# Altium project drone_sensor.PrjPcb
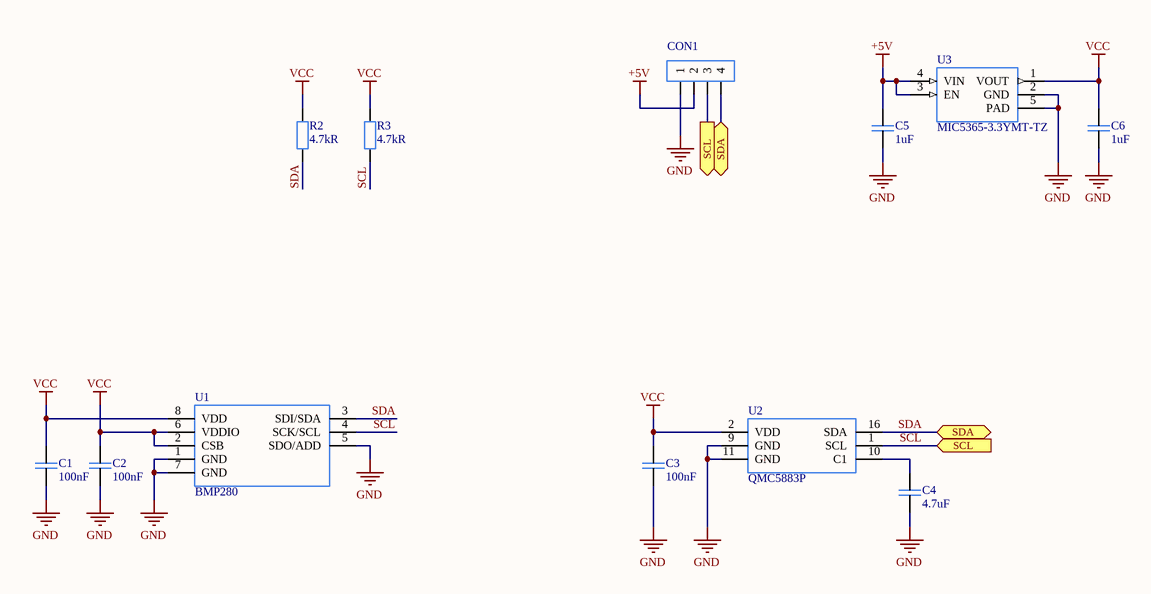
[diagram p0: Sheet1.SchDoc]
1 sheet, 12 parts. Net scope: flat (ports and power ports of the same name join across sheets).
Board file: PCB1.PcbDoc

## Sheet Sheet1.SchDoc
size A4; SheetNumber: 1; SheetTotal: 1

### Parts
C1  100nF  [C0201_M]
C2  100nF  [C0201_M]
C3  100nF  [C0201_M]
C4  4.7uF  [C0402_N]
C5  1uF  [C0201_M]
C6  1uF  [C0201_M]
CON1  Header 4  [HEADER-4-2mm]  (value not drawn)
R2  4.7kR  [R0201_L]
R3  4.7kR  [R0201_L]
U1  BMP280  [LGA-8]
U2  QMC5883P  [LGA-16_3X3]
U3  MIC5365-3.3YMT-TZ  [UDFN-4]

### Ports
SCL (in, see Sheet1[3B]), SCL (out, see Sheet1[3C]), SDA (bidir, see Sheet1[3B]), SDA (bidir, see Sheet1[3C])

### Nets
+5V: C5.1 CON1.2 U3.3(EN) U3.4(VIN)
GND: C1.2 C2.1 C3.1 C4.2 C5.2 C6.2 CON1.1 U1.1(GND) U1.5(SDO/ADD) U1.7(GND) U2.9(GND) U2.11(GND) U3.2(GND) U3.5(PAD)
VCC: C1.1 C2.2 C3.2 C6.1 R2.1 R3.1 U1.2(CSB) U1.6(VDDIO) U1.8(VDD) U2.2(VDD) U3.1(VOUT)
SCL: CON1.3 R3.2 U1.4(SCK/SCL) U2.1(SCL) ; port SCL
SDA: CON1.4 R2.2 U1.3(SDI/SDA) U2.16(SDA) ; port SDA
NetC4_1: C4.1 U2.10(C1)

Not connected (* = marked no-connect by the designer): U2 3(NC) 4(NC) 5(NC) 6(NC) 7(NC) 8(NC) 12(NC) 13(NC) 14(NC) 15(NC)

### Library data of the parts
C1-C3 = Capacitor: Cap Ceramic 0.1uF 25V X5R 10% SMD 0201 85°C Paper T/R; Manufacturer: Yageo; Manufacturer Part Number: CC0201KRX5R8BB104; User_Description: Cap Ceramic 0.1uF 25V X5R 10% SMD 0201 85°C Paper T/R; Supplier: Digi-Key; Supplier Part Number: 13-CC0201KRX5R8BB104CT-ND; RoHS: Yes; Category: Ceramic Capacitors; Stock: 60990; Pricing: 1=0,10000, 10=0,06500, 50=0,03560, 100=0,02900, 500=0,02072, 1000=0,01628, 2500=0,01480, 5000=0,01361 (USD); RoHS Compliant: Yes; ComponentLink1URL: https://www.yageo.com/upload/media/product/productsearch/datasheet/mlcc/UPY-GPHC_X5R_4V-to-50V_26.pdf?src-supplier=Digi-Key; ComponentLink1Description: https://www.yageo.com/upload/media/product/productsearch/datasheet/mlcc/UPY-GPHC_X5R_4V-to-50V_26.pdf?src-supplier=Digi-Key; Value: 100nF
C4 = Capacitor: 贴片电容（MLCC） 0402; Manufacturer: Taiyo Yuden; Manufacturer Part Number: EDK105BBJ475MVLF; User_Description: 贴片电容（MLCC） 0402; Supplier: LCSC; Supplier Part Number: C412302; RoHS: No; Stock: 204180; Pricing: 50=0,01000, 500=0,00800, 1500=0,00700, 10000=0,00630, 20000=0,00580, 50000=0,00540 (USD); Value: 4.7uF
C5 C6 = Capacitor: Cap Cer 1UF 10V X5R 0201; Manufacturer: Kyocera AVX; Manufacture Part Number: CM03X5R105M10AH; Dielectric: C0G; Tolerance: 20%; User_Description: Cap Cer 1UF 10V X5R 0201; Supplier 1: Digi-Key; Supplier Part Number 1: 478-CM03X5R105M10AHCT-ND; RoHS: Yes; Category: Ceramic Capacitors; Stock 1: 539073; Pricing 1: 1=0,13000, 10=0,09200, 50=0,05240, 100=0,04350, 500=0,03050, 1000=0,02525, 2500=0,02350, 5000=0,02150 (USD); Mounting Technology: Surface Mount; Case/Package: Ceramic; Min Operating Temperature: -55°C; Max Operating Temperature: 85°C; Value: 1uF; Packaging: Tape and Reel; Termination: Wraparound; Length: 0.6mm; Lead Free: Lead Free
CON1 = HEADER1X4: Connector; Header; 4pin
R2 R3 = Resistor_EU: Res Thick Film 0201 4.7K Ohm 1% 1/20W ±200ppm/°C Molded SMD SMD Paper T/R; Manufacturer: Yageo; Manufacturer Part Number: RC0201FR-074K7L; Power Rating: 50mW; Voltage Rating: 25V; User_Description: Res Thick Film 0201 4.7K Ohm 1% 1/20W ±200ppm/°C Molded SMD SMD Paper T/R; Supplier: Digi-Key; Supplier Part Number: 311-4.70KMCT-ND; RoHS: Yes; Category: Chip SMD Resistors; Stock: 5686873; Pricing: 1=0,10000, 10=0,03700, 100=0,01500, 1000=0,00672, 2500=0,00583, 5000=0,00482 (USD); Case/Package: 0201; Contact Plating: Tin,Matte; Case Code (Metric): 0603; Case Code (Imperial): 0201; Weight: 6E-06oz; Min Operating Temperature: -55°C; Max Operating Temperature: 125°C; Value: 4.7kR; Tolerance: 1%; Resistor Type: Thick Film; Temperature Coefficient: 200ppm/°C; Packaging: Tape and Reel; Package Quantity: 1; Number of Terminations: 2; Termination: SMD/SMT; Max Power Dissipation: 50mW; Features: Moisture Resistant; Series: RC; Resistance Tolerance: 1%; Construction: Rectangular; Length: 0.6mm; Width: 0.012inch; Height: 0.01inch; Depth: 0.3mm; Radiation Hardening: No; Military Standard: Not; Lead Free: Lead Free; RoHS Compliant: Yes; ComponentLink1URL: https://datasheet.ciiva.com/7672/1563626-7672233.pdf?src-supplier=Element14; ComponentLink1Description: https://datasheet.ciiva.com/7672/1563626-7672233.pdf?src-supplier=Element14; ComponentLink2URL: https://datasheet.ciiva.com/2493/pyu-r-int-thick-7-2493812.pdf?src-supplier=Digi-Key; ComponentLink2Description: https://datasheet.ciiva.com/2493/pyu-r-int-thick-7-2493812.pdf?src-supplier=Digi-Key; ComponentLink3URL: https://datasheet.ciiva.com/2493/pyu-r-int-thick-7-2493813.pdf?src-supplier=Digi-Key; ComponentLink3Description: https://datasheet.ciiva.com/2493/pyu-r-int-thick-7-2493813.pdf?src-supplier=Digi-Key; ComponentLink4URL: https://datasheet.ciiva.com/2493/pyu-r-int-thick-7-2493811.pdf?src-supplier=Digi-Key; ComponentLink4Description: https://datasheet.ciiva.com/2493/pyu-r-int-thick-7-2493811.pdf?src-supplier=Digi-Key; ComponentLink5URL: https://datasheet.ciiva.com/8892/pyu-rc0201-51-rohs-l-8-8892942.pdf?src-supplier=Avnet; ComponentLink5Description: https://datasheet.ciiva.com/8892/pyu-rc0201-51-rohs-l-8-8892942.pdf?src-supplier=Avnet
U1 = BMP280: SENSOR PRESSURE ABS; Manufacturer: Bosch; Output Type: SPI,I2C; Pressure Type: Absolute; Operating Pressure: 15.95PSI; Port Style: No Port; Max Pressure: 290.08PSI; User_Description: SENSOR PRESSURE ABS; Supplier: LCSC; Supplier Part Number: C83291; Manufacturer Part Number: BMP280; RoHS: No; Category: Pressure Sensors; Stock: 11152; Pricing: 1=1,5655, 10=1,4144, 30=1,2712, 100=1,0851, 500=1,0421, 1000=1,0198 (USD); Case/Package: SMD/SMT; Pins: 8; Min Operating Temperature: -40°C; Max Operating Temperature: 85°C; Termination: SMD/SMT; Lead Free: Lead Free; ComponentLink1URL: https://ae-bst.resource.bosch.com/media/_tech/media/datasheets/BST-BMP280-DS001.pdf?src-supplier=Digi-Key; ComponentLink1Description: https://ae-bst.resource.bosch.com/media/_tech/media/datasheets/BST-BMP280-DS001.pdf?src-supplier=Digi-Key; ComponentLink2URL: https://datasheet.octopart.com/BMP280-Bosch-Sensortec-datasheet-121363206.pdf?src-supplier=LKR; ComponentLink2Description: https://datasheet.octopart.com/BMP280-Bosch-Sensortec-datasheet-121363206.pdf?src-supplier=LKR
U3 = MIC5365-3.3YMT-TZ: MIC5365 Series 3.3 V Fixed Output 150 mA Surface Mount LDO Regulator - TMLF-4; Manufacturer: Microchip; Output Voltage: 3.3V; Output Current: 150mA; Dropout Voltage: 155mV; Number of Regulators: 1; Min Current Limit: 200mA; Max Supply Voltage: 5.5V; Min Input Voltage: 2.5V; User_Description: MIC5365 Series 3.3 V Fixed Output 150 mA Surface Mount LDO Regulator - TMLF-4; Supplier: Digi-Key; Supplier Part Number: MIC5365-3.3YMT-TZCT-ND; Manufacturer Part Number: MIC5365-3.3YMT-TZ; RoHS: Yes; Category: Voltage Regulators - Linear; Stock: 28410; Pricing: 1=0,18, 25=0,15, 100=0,12 (USD); Mounting Technology: Surface Mount; Min Operating Temperature: -40°C; Max Operating Temperature: 125°C; Packaging: Tape and Reel; Package Quantity: 10000; Max Output current: 150mA; Min Output Voltage: 3.3V; Lead Free: Lead Free; ComponentLink1URL: https://datasheet.ciiva.com/2060/mic5365-2060298.pdf?src-supplier=Digi-Key; ComponentLink1Description: https://datasheet.ciiva.com/2060/mic5365-2060298.pdf?src-supplier=Digi-Key; ComponentLink2URL: https://datasheet.ciiva.com/16466/mic5365-16466607.pdf?src-supplier=Future+Electronics; ComponentLink2Description: https://datasheet.ciiva.com/16466/mic5365-16466607.pdf?src-supplier=Future+Electronics